# EAGLE design LED_Cube_MAX6966 (EAGLE 7.5.0)
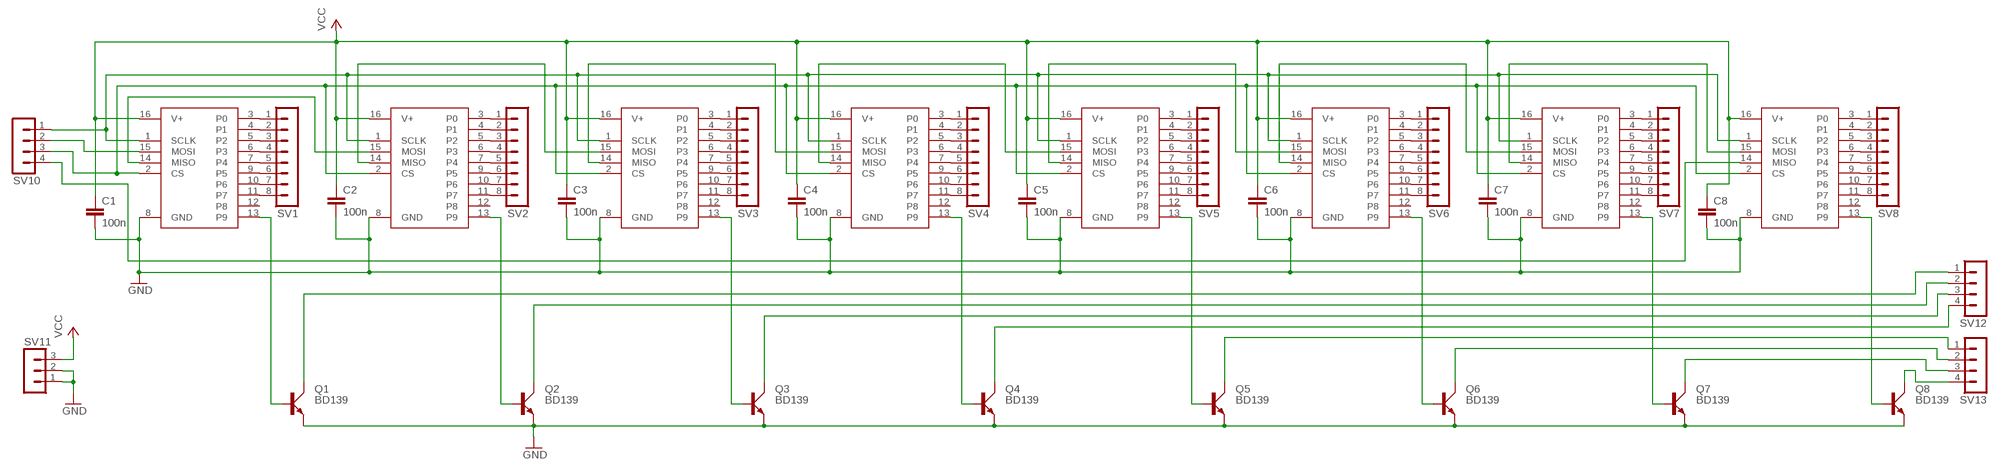
[diagram p0: schematic, sheet 1]

## Parts
C1  100n  C-EU025_050-025X075  [C025_050-025X075]
C2  100n  C-EU025_050-025X075  [C025_050-025X075]
C3  100n  C-EU025_050-025X075  [C025_050-025X075]
C4  100n  C-EU025_050-025X075  [C025_050-025X075]
C5  100n  C-EU025_050-025X075  [C025_050-025X075]
C6  100n  C-EU025_050-025X075  [C025_050-025X075]
C7  100n  C-EU025_050-025X075  [C025_050-025X075]
C8  100n  C-EU025_050-025X075  [C025_050-025X075]
Q1  BD139  [TO126AV]
Q2  BD139  [TO126AV]
Q3  BD139  [TO126AV]
Q4  BD139  [TO126AV]
Q5  BD139  [TO126AV]
Q6  BD139  [TO126AV]
Q7  BD139  [TO126AV]
Q8  BD139  [TO126AV]
SV1  MA08-1  [MA08-1]
SV2  MA08-1  [MA08-1]
SV3  MA08-1  [MA08-1]
SV4  MA08-1  [MA08-1]
SV5  MA08-1  [MA08-1]
SV6  MA08-1  [MA08-1]
SV7  MA08-1  [MA08-1]
SV8  MA08-1  [MA08-1]
SV10  MA04-1  [MA04-1]
SV11  MA03-1  [MA03-1]
SV12  MA04-1  [MA04-1]
SV13  MA04-1  [MA04-1]
U$1  MAX6966  [QSOP16]
U$2  MAX6966  [QSOP16]
U$3  MAX6966  [QSOP16]
U$4  MAX6966  [QSOP16]
U$5  MAX6966  [QSOP16]
U$6  MAX6966  [QSOP16]
U$7  MAX6966  [QSOP16]
U$8  MAX6966  [QSOP16]

## Nets
GND: C1.2 C2.2 C3.2 C4.2 C5.2 C6.2 C7.2 C8.2 Q1.E Q2.E Q3.E Q4.E Q5.E Q6.E Q7.E Q8.E SV11.1 SV11.2 U$1.8(GND) U$2.8(GND) U$3.8(GND) U$4.8(GND) U$5.8(GND) U$6.8(GND) U$7.8(GND) U$8.8(GND)
N$1: SV1.1 U$1.3(P0)
N$2: SV1.2 U$1.4(P1)
N$3: SV1.3 U$1.5(P2)
N$4: SV1.4 U$1.6(P3)
N$5: SV1.5 U$1.7(P4)
N$6: SV1.6 U$1.9(P5)
N$7: SV1.7 U$1.10(P6)
N$8: SV1.8 U$1.11(P7)
N$9: SV2.1 U$2.3(P0)
N$10: SV2.2 U$2.4(P1)
N$11: SV2.3 U$2.5(P2)
N$12: SV2.4 U$2.6(P3)
N$13: SV2.5 U$2.7(P4)
N$14: SV2.6 U$2.9(P5)
N$15: SV2.7 U$2.10(P6)
N$16: SV2.8 U$2.11(P7)
N$17: SV3.1 U$3.3(P0)
N$18: SV3.2 U$3.4(P1)
N$19: SV3.3 U$3.5(P2)
N$20: SV3.4 U$3.6(P3)
N$21: SV3.5 U$3.7(P4)
N$22: SV3.6 U$3.9(P5)
N$23: SV3.7 U$3.10(P6)
N$24: SV3.8 U$3.11(P7)
N$25: SV4.1 U$4.3(P0)
N$26: SV4.2 U$4.4(P1)
N$27: SV4.3 U$4.5(P2)
N$28: SV4.4 U$4.6(P3)
N$29: SV4.5 U$4.7(P4)
N$30: SV4.6 U$4.9(P5)
N$31: SV4.7 U$4.10(P6)
N$32: SV4.8 U$4.11(P7)
N$33: SV5.1 U$5.3(P0)
N$34: SV5.2 U$5.4(P1)
N$35: SV5.3 U$5.5(P2)
N$36: SV5.4 U$5.6(P3)
N$37: SV5.5 U$5.7(P4)
N$38: SV5.6 U$5.9(P5)
N$39: SV5.7 U$5.10(P6)
N$40: SV5.8 U$5.11(P7)
N$41: SV6.1 U$6.3(P0)
N$42: SV6.2 U$6.4(P1)
N$43: SV6.3 U$6.5(P2)
N$44: SV6.4 U$6.6(P3)
N$45: SV6.5 U$6.7(P4)
N$46: SV6.6 U$6.9(P5)
N$47: SV6.7 U$6.10(P6)
N$48: SV6.8 U$6.11(P7)
N$49: SV7.1 U$7.3(P0)
N$50: SV7.2 U$7.4(P1)
N$51: SV7.3 U$7.5(P2)
N$52: SV7.4 U$7.6(P3)
N$53: SV7.5 U$7.7(P4)
N$54: SV7.6 U$7.9(P5)
N$55: SV7.7 U$7.10(P6)
N$56: SV7.8 U$7.11(P7)
N$57: SV8.1 U$8.3(P0)
N$58: SV8.2 U$8.4(P1)
N$59: SV8.3 U$8.5(P2)
N$60: SV8.4 U$8.6(P3)
N$61: SV8.5 U$8.7(P4)
N$62: SV8.6 U$8.9(P5)
N$63: SV8.7 U$8.10(P6)
N$64: SV8.8 U$8.11(P7)
N$65: U$4.14(MISO) U$5.15(MOSI)
N$66: Q8.B U$8.13(P9)
N$67: SV10.3 U$1.2(CS) U$2.2(CS) U$3.2(CS) U$4.2(CS) U$5.2(CS) U$6.2(CS) U$7.2(CS) U$8.2(CS)
N$68: Q7.B U$7.13(P9)
N$69: Q6.B U$6.13(P9)
N$70: Q5.B U$5.13(P9)
N$71: Q4.B U$4.13(P9)
N$73: Q3.B U$3.13(P9)
N$74: Q2.B U$2.13(P9)
N$75: Q1.B U$1.13(P9)
N$77: Q8.C SV13.4
N$78: Q7.C SV13.3
N$79: SV10.1 U$1.1(SCLK) U$2.1(SCLK) U$3.1(SCLK) U$4.1(SCLK) U$5.1(SCLK) U$6.1(SCLK) U$7.1(SCLK) U$8.1(SCLK)
N$80: Q6.C SV13.2
N$81: Q5.C SV13.1
N$82: Q4.C SV12.4
N$83: Q3.C SV12.3
N$84: Q2.C SV12.2
N$85: Q1.C SV12.1
N$86: U$1.14(MISO) U$2.15(MOSI)
N$87: SV10.2 U$1.15(MOSI)
N$88: U$2.14(MISO) U$3.15(MOSI)
N$89: U$3.14(MISO) U$4.15(MOSI)
N$90: U$7.14(MISO) U$8.15(MOSI)
N$91: U$5.14(MISO) U$6.15(MOSI)
N$92: U$6.14(MISO) U$7.15(MOSI)
N$93: SV10.4 U$8.14(MISO)
VCC: C1.1 C2.1 C3.1 C4.1 C5.1 C6.1 C7.1 C8.1 SV11.3 U$1.16(V+) U$2.16(V+) U$3.16(V+) U$4.16(V+) U$5.16(V+) U$6.16(V+) U$7.16(V+) U$8.16(V+)
Unconnected: U$1.12(P8) U$2.12(P8) U$3.12(P8) U$4.12(P8) U$5.12(P8) U$6.12(P8) U$7.12(P8) U$8.12(P8)

## Library data of the parts
C1-C8 = rcl:C-EU: CAPACITOR, European symbol
Q1-Q8 = transistor-power:BD139: NPN TRANSISTOR
SV1-SV8 = con-lstb:MA08-1: PIN HEADER; OC_FARNELL: unknown; OC_NEWARK: unknown
SV10 SV12 SV13 = con-lstb:MA04-1: PIN HEADER; OC_FARNELL: unknown; OC_NEWARK: unknown
SV11 = con-lstb:MA03-1: PIN HEADER; OC_FARNELL: unknown; OC_NEWARK: unknown
U$1-U$8 = MAX6966:MAX6966

## Board
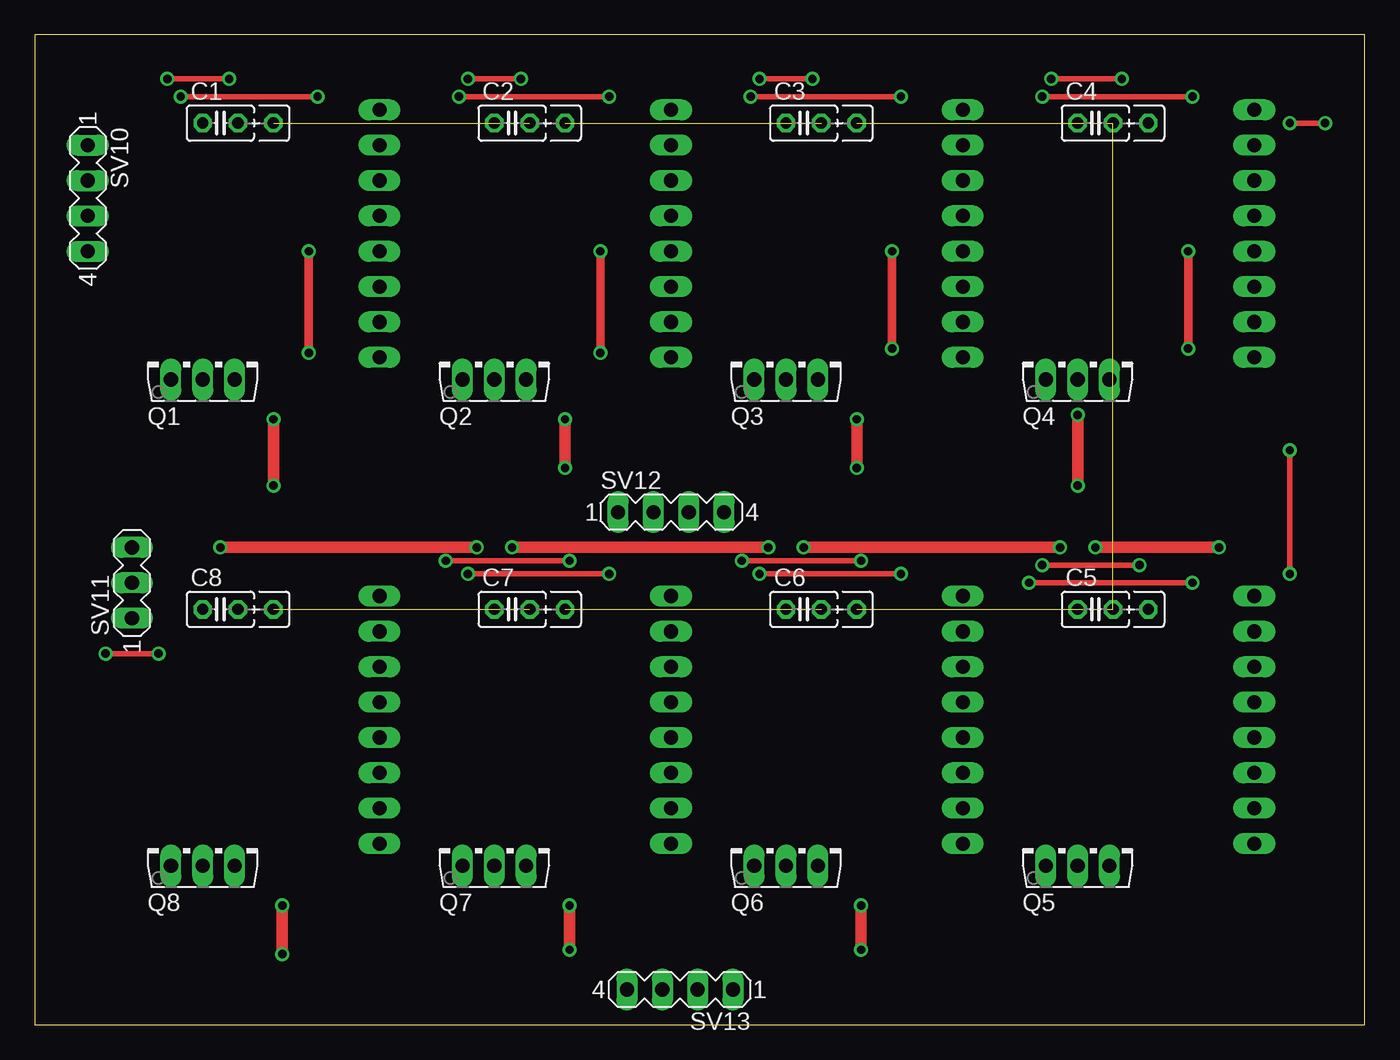
[diagram p1: board, top side]
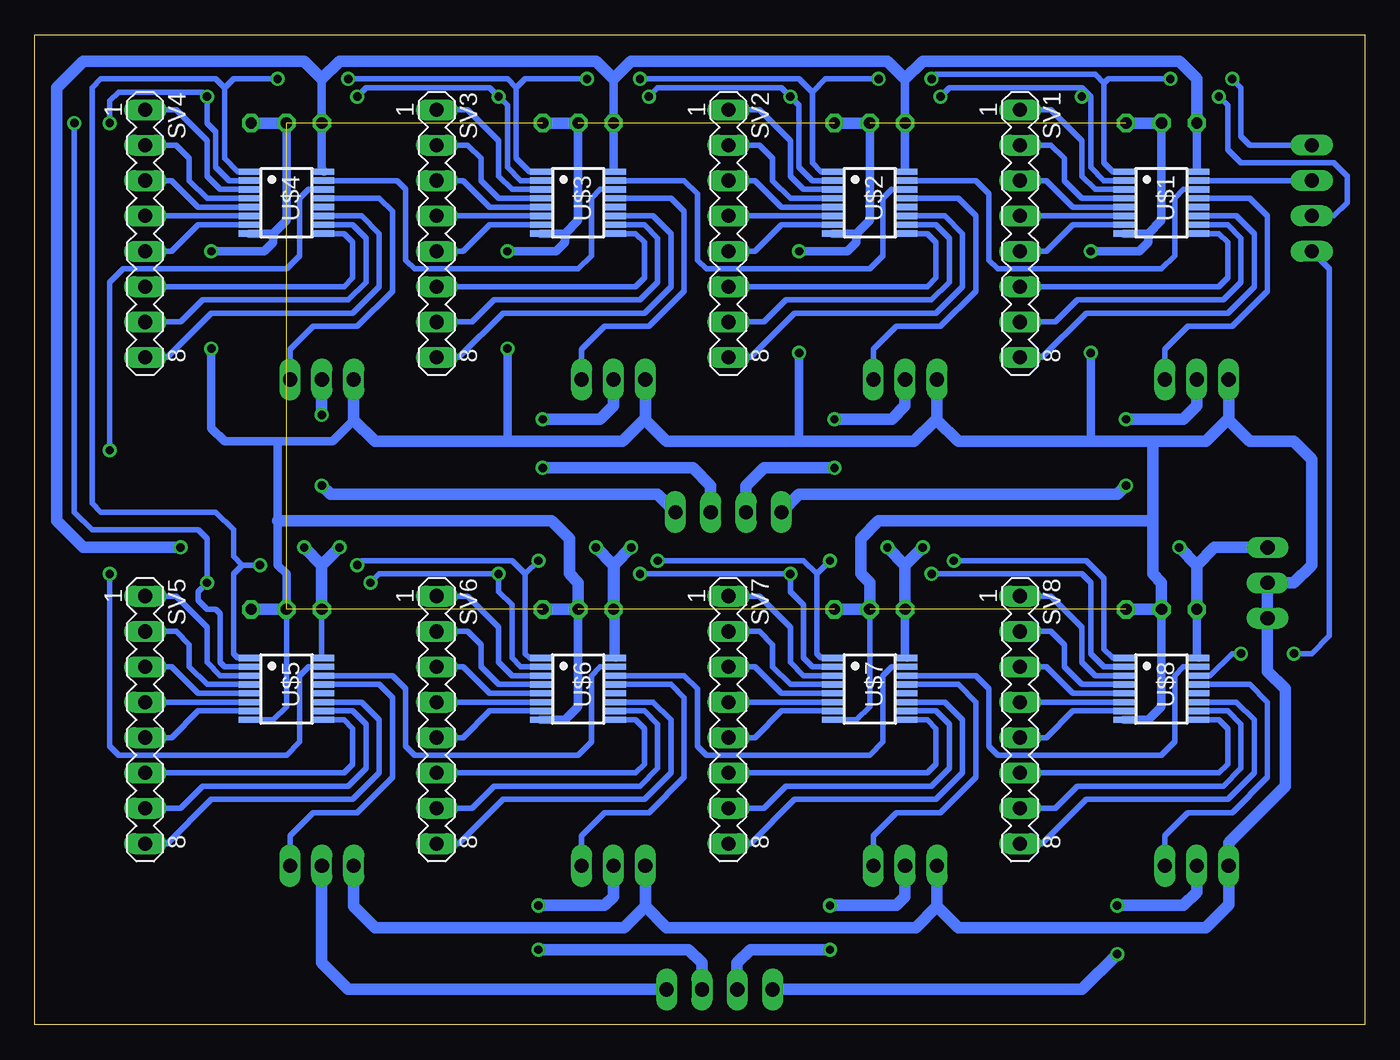
[diagram p2: board, bottom side, seen from below]

Size 95.55 x 71.11 mm. Coordinates in mm from the lower left corner, seen from the top.
Outline: 0,0 95.55,0 95.55,71.11 0,71.11 0,0
Copper layers (1*16): Top 0.035mm / dielectric 1.5mm / Bottom 0.035mm
Design rules "default": minimum track width 10mil, minimum drill 24mil, track to track 8mil, track to pad 8mil, pad to pad 8mil, via to via 8mil, smd to smd 8mil, copper to edge 40mil, drill to drill 8mil, minimum pad ring 10mil, minimum via ring 8mil, stop-mask expansion 4mil, vias tented up to drill 0mil, thermal gap 10mil

### Footprints (pad centres in the part's own frame; a part is rotated, then mirrored left to right if it is on the bottom)
C025_050-025X075 = drill 0.813 octagon: 1 -1.27,0; 2 1.27,0; 3 3.81,0
TO126AV = drill 1.016 long: B 2.286,-1.27; C 0,-1.27; E -2.286,-1.27
MA08-1 = drill 1.016 long: 1 -8.89,0; 2 -6.35,0; 3 -3.81,0; 4 -1.27,0; 5 1.27,0; 6 3.81,0; 7 6.35,0; 8 8.89,0
MA04-1 = drill 1.016 long: 1 -3.81,0; 2 -1.27,0; 3 1.27,0; 4 3.81,0
MA03-1 = drill 1.016 long: 1 -2.54,0; 2 0,0; 3 2.54,0
QSOP16 = smd 0.45 x 1.5: 1 -2.223,-2.69; 2 -1.587,-2.69; 3 -0.953,-2.69; 4 -0.318,-2.69; 5 0.318,-2.69; 6 0.953,-2.69; 7 1.587,-2.69; 8 2.223,-2.69; 9 2.223,2.69; 10 1.587,2.69; 11 0.953,2.69; 12 0.318,2.69; 13 -0.318,2.69; 14 -0.953,2.69; 15 -1.587,2.69; 16 -2.223,2.69

### Placement (x,y rotation side)
C1  13.34,64.77 0 top
C2  34.29,64.77 0 top
C3  55.25,64.77 0 top
C4  76.2,64.77 0 top
C5  76.2,29.84 0 top
C6  55.25,29.84 0 top
C7  34.29,29.84 0 top
C8  13.34,29.84 0 top
Q1  12.06,47.62 0 top
Q2  33.02,47.62 0 top
Q3  53.98,47.62 0 top
Q4  74.93,47.62 0 top
Q5  74.93,12.7 0 top
Q6  53.98,12.7 0 top
Q7  33.02,12.7 0 top
Q8  12.06,12.7 0 top
SV1  24.76,56.83 270 bottom
SV2  45.72,56.83 270 bottom
SV3  66.67,56.83 270 bottom
SV4  87.63,56.83 270 bottom
SV5  87.63,21.91 270 bottom
SV6  66.67,21.91 270 bottom
SV7  45.72,21.91 270 bottom
SV8  24.76,21.91 270 bottom
SV10  3.81,59.37 270 top
SV11  6.99,31.75 90 top
SV12  45.72,36.83 0 top
SV13  46.36,2.54 180 top
U$1  14.61,59.05 270 bottom
U$2  35.56,59.05 270 bottom
U$3  56.52,59.05 270 bottom
U$4  77.47,59.05 270 bottom
U$5  77.47,24.13 270 bottom
U$6  56.52,24.13 270 bottom
U$7  35.56,24.13 270 bottom
U$8  14.61,24.13 270 bottom

### Tracks (layer width: path | path; a pad name or v marks a point on that pad's centre or on a via)
GND  (via drill 0.6)
  Top 0.61: v19.68,55.56 v19.68,48.26 | v40.64,55.56 v40.64,48.26 | v61.59,55.56 v61.59,48.58 | v82.87,55.56 v82.87,48.58
  Bottom 0.406: C7.2 35.56,22.86 36.51,21.91 U$7.8 | C5.2 77.47,22.86 78.42,21.91 U$5.8
  Bottom 0.61: 78.42,56.83 77.47,57.79 C4.2 | 78.42,56.83 U$4.8 | U$3.8 57.47,56.83 | 57.47,56.83 56.52,57.79 C3.2 | C2.2 35.56,57.79 36.51,56.83 | U$2.8 36.51,56.83 | C1.2 14.61,57.79 15.56,56.83 | U$1.8 15.56,56.83 | C8.2 14.61,22.86 15.56,21.91 U$8.8 | C6.2 56.52,22.86 57.47,21.91 U$6.8 | 15.56,56.83 15.56,56.2 16.19,55.56 v19.68,55.56 | v19.68,48.26 19.68,41.91 | 36.51,56.83 36.51,56.2 37.15,55.56 v40.64,55.56 | v40.64,48.26 40.64,41.91 | 57.47,56.83 57.47,56.2 58.1,55.56 v61.59,55.56 | v61.59,48.58 61.59,41.91 | 78.42,56.83 78.42,56.2 79.06,55.56 v82.87,55.56 | v82.87,48.58 82.87,42.86 81.91,41.91 78.1,41.91 | 78.1,41.91 74.17,41.91 72.64,43.43 | C5.2 77.47,32.38 78.1,33.02 78.1,36.2 78.1,41.91
  Bottom 0.813: 15.24,41.91 19.68,41.91 29.21,41.91 30.73,43.43 | C6.2 56.52,31.75 57.15,32.38 57.15,34.92 58.42,36.2 78.1,36.2 | C7.2 35.56,31.75 36.2,32.38 36.2,34.92 34.93,36.2 15.24,36.2 | C8.2 14.61,31.75 15.24,32.38 15.24,36.2 | 15.24,36.2 15.24,41.91 | Q7.E 30.73,8.51 | 30.73,8.51 29.21,6.98 11.43,6.98 9.78,8.64 Q8.E 9.78,13.08 5.71,17.14 5.71,24.13 6.99,25.4 SV11.1 SV11.2 5.08,31.75 3.81,33.02 3.81,40.64 5.08,41.91 8.26,41.91 9.78,43.43 | Q6.E 51.69,8.51 | 51.69,8.51 50.16,6.98 32.26,6.98 30.73,8.51 | Q5.E 72.64,8.51 71.12,6.98 53.21,6.98 51.69,8.51 | Q1.E 9.78,43.43 | 9.78,43.43 9.91,43.43 11.43,41.91 15.24,41.91 | Q2.E 30.73,43.43 | 30.73,43.43 30.86,43.43 32.39,41.91 40.64,41.91 50.16,41.91 51.69,43.43 Q3.E 51.69,43.56 53.34,41.91 61.59,41.91 71.12,41.91 72.64,43.43 Q4.E
N$1
  Bottom 0.406: U$1.3 19.37,60.01 20.32,60.96 20.32,63.5 22.54,65.72 SV1.1
N$2
  Bottom 0.406: U$1.4 20.32,59.37 21.59,60.64 21.59,62.23 22.54,63.18 SV1.2
N$3
  Bottom 0.406: U$1.5 20.95,58.74 22.86,60.64 SV1.3
N$4
  Bottom 0.406: U$1.6 SV1.4
N$5
  Bottom 0.406: U$1.7 20.95,57.47 22.86,55.56 SV1.5
N$6
  Bottom 0.406: SV1.6 10.48,53.02 9.84,53.66 9.84,56.2 10.48,56.83 U$1.9
N$7
  Bottom 0.406: U$1.10 9.84,57.47 8.89,56.51 8.89,53.34 10.16,52.07 20.64,52.07 22.22,50.48 SV1.7
N$8
  Bottom 0.406: U$1.11 9.21,58.1 7.94,56.83 7.94,53.02 9.84,51.12 20,51.12 23.18,47.94 SV1.8
N$9
  Bottom 0.406: SV2.1 43.5,65.72 41.27,63.5 41.27,60.96 40.32,60.01 U$2.3
N$10
  Bottom 0.406: SV2.2 43.5,63.18 42.55,62.23 42.55,60.64 41.27,59.37 U$2.4
N$11
  Bottom 0.406: SV2.3 43.82,60.64 41.91,58.74 U$2.5
N$12
  Bottom 0.406: U$2.6 SV2.4
N$13
  Bottom 0.406: U$2.7 41.91,57.47 43.82,55.56 SV2.5
N$14
  Bottom 0.406: SV2.6 31.43,53.02 30.8,53.66 30.8,56.2 31.43,56.83 U$2.9
N$15
  Bottom 0.406: SV2.7 43.18,50.48 41.59,52.07 31.11,52.07 29.84,53.34 29.84,56.51 30.8,57.47 U$2.10
N$16
  Bottom 0.406: SV2.8 44.13,47.94 40.96,51.12 30.8,51.12 28.89,53.02 28.89,56.83 30.16,58.1 U$2.11
N$17
  Bottom 0.406: SV3.1 64.45,65.72 62.23,63.5 62.23,60.96 61.28,60.01 U$3.3
N$18
  Bottom 0.406: SV3.2 64.45,63.18 63.5,62.23 63.5,60.64 62.23,59.37 U$3.4
N$19
  Bottom 0.406: SV3.3 64.77,60.64 62.87,58.74 U$3.5
N$20
  Bottom 0.406: SV3.4 U$3.6
N$21
  Bottom 0.406: U$3.7 62.87,57.47 64.77,55.56 SV3.5
N$22
  Bottom 0.406: U$3.9 52.39,56.83 51.75,56.2 51.75,53.66 52.39,53.02 SV3.6
N$23
  Bottom 0.406: U$3.10 51.75,57.47 50.8,56.51 50.8,53.34 52.07,52.07 62.55,52.07 64.13,50.48 SV3.7
N$24
  Bottom 0.406: SV3.8 65.09,47.94 61.91,51.12 51.75,51.12 49.85,53.02 49.85,56.83 51.12,58.1 U$3.11
N$25
  Bottom 0.406: SV4.1 85.41,65.72 83.18,63.5 83.18,60.96 82.23,60.01 U$4.3
N$26
  Bottom 0.406: SV4.2 85.41,63.18 84.45,62.23 84.45,60.64 83.18,59.37 U$4.4
N$27
  Bottom 0.406: SV4.3 85.72,60.64 83.82,58.74 U$4.5
N$28
  Bottom 0.406: SV4.4 U$4.6
N$29
  Bottom 0.406: SV4.5 85.72,55.56 83.82,57.47 U$4.7
N$30
  Bottom 0.406: U$4.9 73.34,56.83 72.71,56.2 72.71,53.66 73.34,53.02 SV4.6
N$31
  Bottom 0.406: U$4.10 72.71,57.47 71.75,56.51 71.75,53.34 73.02,52.07 83.5,52.07 85.09,50.48 SV4.7
N$32
  Bottom 0.406: U$4.11 72.07,58.1 70.8,56.83 70.8,53.02 72.71,51.12 82.87,51.12 86.04,47.94 SV4.8
N$33
  Bottom 0.406: U$5.3 82.23,25.08 83.18,26.03 83.18,28.57 85.41,30.8 SV5.1
N$34
  Bottom 0.406: U$5.4 83.18,24.45 84.45,25.72 84.45,27.3 85.41,28.26 SV5.2
N$35
  Bottom 0.406: U$5.5 83.82,23.81 85.72,25.72 SV5.3
N$36
  Bottom 0.406: U$5.6 SV5.4
N$37
  Bottom 0.406: U$5.7 83.82,22.54 85.72,20.64 SV5.5
N$38
  Bottom 0.406: U$5.9 73.34,21.91 72.71,21.27 72.71,18.73 73.34,18.1 SV5.6
N$39
  Bottom 0.406: U$5.10 72.71,22.54 71.75,21.59 71.75,18.41 73.02,17.14 83.5,17.14 85.09,15.56 SV5.7
N$40
  Bottom 0.406: U$5.11 72.07,23.18 70.8,21.91 70.8,18.1 72.71,16.19 82.87,16.19 86.04,13.02 SV5.8
N$41
  Bottom 0.406: SV6.1 64.45,30.8 62.23,28.57 62.23,26.03 61.28,25.08 U$6.3
N$42
  Bottom 0.406: SV6.2 64.45,28.26 63.5,27.3 63.5,25.72 62.23,24.45 U$6.4
N$43
  Bottom 0.406: SV6.3 64.77,25.72 62.87,23.81 U$6.5
N$44
  Bottom 0.406: SV6.4 U$6.6
N$45
  Bottom 0.406: U$6.7 62.87,22.54 64.77,20.64 SV6.5
N$46
  Bottom 0.406: U$6.9 52.39,21.91 51.75,21.27 51.75,18.73 52.39,18.1 SV6.6
N$47
  Bottom 0.406: U$6.10 51.75,22.54 50.8,21.59 50.8,18.41 52.07,17.14 62.55,17.14 64.13,15.56 SV6.7
N$48
  Bottom 0.406: U$6.11 51.12,23.18 49.85,21.91 49.85,18.1 51.75,16.19 61.91,16.19 65.09,13.02 SV6.8
N$49
  Bottom 0.406: U$7.3 40.32,25.08 41.27,26.03 41.27,28.57 43.5,30.8 SV7.1
N$50
  Bottom 0.406: U$7.4 41.27,24.45 42.55,25.72 42.55,27.3 43.5,28.26 SV7.2
N$51
  Bottom 0.406: U$7.5 41.91,23.81 43.82,25.72 SV7.3
N$52
  Bottom 0.406: U$7.6 SV7.4
N$53
  Bottom 0.406: U$7.7 41.91,22.54 43.82,20.64 SV7.5
N$54
  Bottom 0.406: U$7.9 31.43,21.91 30.8,21.27 30.8,18.73 31.43,18.1 SV7.6
N$55
  Bottom 0.406: U$7.10 30.8,22.54 29.84,21.59 29.84,18.41 31.11,17.14 41.59,17.14 43.18,15.56 SV7.7
N$56
  Bottom 0.406: U$7.11 30.16,23.18 28.89,21.91 28.89,18.1 30.8,16.19 40.96,16.19 44.13,13.02 SV7.8
N$57
  Bottom 0.406: U$8.3 19.37,25.08 20.32,26.03 20.32,28.57 22.54,30.8 SV8.1
N$58
  Bottom 0.406: U$8.4 20.32,24.45 21.59,25.72 21.59,27.3 22.54,28.26 SV8.2
N$59
  Bottom 0.406: U$8.5 20.95,23.81 22.86,25.72 SV8.3
N$60
  Bottom 0.406: U$8.6 SV8.4
N$61
  Bottom 0.406: U$8.7 20.95,22.54 22.86,20.64 SV8.5
N$62
  Bottom 0.406: U$8.9 10.48,21.91 9.84,21.27 9.84,18.73 10.48,18.1 SV8.6
N$63
  Bottom 0.406: SV8.7 22.22,15.56 20.64,17.14 10.16,17.14 8.89,18.41 8.89,21.59 9.84,22.54 U$8.10
N$64
  Bottom 0.406: U$8.11 9.21,23.18 7.94,21.91 7.94,18.1 9.84,16.19 20,16.19 23.18,13.02 SV8.8
N$65  (via drill 0.6)
  Top 0.406: v90.17,41.27 v90.17,32.38
  Bottom 0.406: U$4.14 75.88,60.01 76.52,59.37 76.52,55.24 77.47,54.29 89.22,54.29 90.17,53.34 v90.17,41.27 | v90.17,32.38 90.17,20 89.53,19.37 77.47,19.37 76.52,20.32 76.52,25.08 75.88,25.72 U$5.15
N$66
  Bottom 0.406: U$8.13 8.26,24.45 6.99,23.18 6.99,17.78 9.53,15.24 12.7,15.24 14.35,13.59 Q8.B
N$67  (via drill 0.6)
  Top 0.406: v51.44,66.68 v62.23,66.68 | v30.48,66.68 v41.27,66.68 | v83.18,66.68 v72.39,66.68 | v31.11,32.38 v41.27,32.38 | v52.07,32.38 v62.23,32.38 | v71.44,31.75 v83.18,31.75 | v10.48,66.68 v20.32,66.68 | v92.71,64.77 v90.17,64.77
  Bottom 0.406: 38.1,60.64 U$2.2 | U$2.2 37.78,60.64 | U$1.2 18.73,60.64 19.68,61.59 19.68,66.68 20,66.99 | U$2.2 39.69,60.64 40.64,61.59 40.64,66.04 v41.27,66.68 41.91,67.31 50.8,67.31 v51.44,66.68 | U$3.2 60.64,60.64 61.59,61.59 61.59,66.04 v62.23,66.68 62.87,67.31 71.75,67.31 v72.39,66.68 | 20,66.99 20.32,67.31 29.84,67.31 v30.48,66.68 | U$4.2 81.6,60.64 82.55,61.59 82.55,64.14 83.18,64.77 v83.18,66.68 83.5,66.99 89.53,66.99 90.17,66.36 v90.17,64.77 | U$8.2 18.73,25.72 19.68,26.67 19.68,31.75 20.32,32.38 v31.11,32.38 | U$7.2 39.69,25.72 40.32,26.35 40.32,30.16 41.27,31.11 v41.27,32.38 v52.07,32.38 | U$6.2 60.64,25.72 61.28,26.35 61.28,30.16 62.23,31.11 v62.23,32.38 70.8,32.38 v71.44,31.75 | U$5.2 81.91,25.72 82.23,26.03 82.23,29.53 82.55,29.84 83.18,29.84 83.82,30.48 83.82,31.11 v83.18,31.75 83.18,34.92 83.82,35.56 91.44,35.56 92.71,36.83 v92.71,64.77 | SV10.3 2.22,58.1 1.27,59.05 1.27,60.96 2.22,61.91 8.89,61.91 9.84,62.87 9.84,66.04 v10.48,66.68 | v20.32,66.68 20,66.99
N$68
  Bottom 0.406: U$7.13 29.21,24.45 27.94,23.18 27.94,17.78 30.48,15.24 33.66,15.24 35.31,13.59 Q7.B
N$69
  Bottom 0.406: U$6.13 49.85,24.45 48.9,23.49 48.9,17.78 51.44,15.24 54.61,15.24 56.26,13.59 Q6.B
N$70
  Bottom 0.406: U$5.13 70.8,24.45 69.85,23.49 69.85,17.78 72.39,15.24 75.56,15.24 77.22,13.59 Q5.B
N$71
  Bottom 0.406: U$4.13 70.8,59.37 69.85,58.42 69.85,52.7 72.39,50.16 75.56,50.16 77.22,48.51 Q4.B
N$73
  Bottom 0.406: U$3.13 49.85,59.37 48.9,58.42 48.9,52.7 51.44,50.16 54.61,50.16 56.26,48.51 Q3.B
N$74
  Bottom 0.406: U$2.13 29.21,59.37 27.94,58.1 27.94,52.7 30.48,50.16 33.66,50.16 35.31,48.51 Q2.B
N$75
  Bottom 0.406: U$1.13 8.26,59.37 6.99,58.1 6.99,52.7 9.53,50.16 12.7,50.16 14.35,48.51 Q1.B
N$77  (via drill 0.6)
  Top 0.813: v17.78,8.57 v17.78,5.08
  Bottom 0.813: Q8.C 12.06,9.53 13.02,8.57 v17.78,8.57 | v17.78,5.08 20.32,2.54 SV13.4
N$78  (via drill 0.6)
  Top 0.813: v38.42,8.57 v38.42,5.4
  Bottom 0.813: Q7.C 33.02,9.21 33.66,8.57 v38.42,8.57 | v38.42,5.4 44.13,5.4 45.09,4.44 SV13.3
N$79  (via drill 0.6)
  Top 0.406: v52.07,67.95 v55.88,67.95 | v31.11,67.95 v34.93,67.95 | v73.02,67.95 v78.1,67.95 | v29.53,33.34 v38.42,33.34 | v50.8,33.34 v59.37,33.34 | v72.39,33.02 v79.38,33.02 | v9.53,67.95 v13.97,67.95
  Bottom 0.406: U$1.1 18.1,61.28 18.73,61.91 18.73,67.63 | U$2.1 39.05,61.28 39.69,61.91 39.69,66.99 | U$3.1 60.01,61.28 60.96,62.23 60.96,67.31 | U$4.1 80.96,61.28 81.91,62.23 81.91,67.31 | 39.69,66.99 40.64,67.95 v52.07,67.95 | v55.88,67.95 60.33,67.95 60.96,67.31 | v31.11,67.95 30.8,68.26 19.37,68.26 18.73,67.63 | v34.93,67.95 38.73,67.95 39.69,66.99 | 60.96,67.31 61.59,67.95 v73.02,67.95 | v78.1,67.95 81.28,67.95 81.91,67.31 | U$8.1 18.1,26.35 18.73,26.99 18.73,32.07 20,33.34 v29.53,33.34 | 39.37,32.38 39.37,26.67 39.05,26.35 U$7.1 | v38.42,33.34 39.37,32.38 | 39.37,32.38 40.32,33.34 v50.8,33.34 | 60.33,32.38 60.33,26.67 60.01,26.35 U$6.1 | v59.37,33.34 60.33,32.38 | 60.33,32.38 61.28,33.34 72.07,33.34 v72.39,33.02 | U$5.1 80.96,26.35 81.28,26.67 81.28,32.38 80.64,33.02 | 80.64,33.02 v79.38,33.02 | v9.53,67.95 8.89,67.31 8.89,63.82 8.26,63.18 SV10.1 | v13.97,67.95 18.41,67.95 18.73,67.63 | 81.91,67.31 82.55,67.95 90.8,67.95 91.44,67.31 91.44,37.46 90.8,36.83 82.55,36.83 81.28,35.56 81.28,33.65 80.64,33.02
N$80  (via drill 0.6)
  Top 0.813: v59.37,8.57 v59.37,5.4
  Bottom 0.813: Q6.C 53.98,9.21 54.61,8.57 v59.37,8.57 | v59.37,5.4 48.58,5.4 47.62,4.44 SV13.2
N$81
  Bottom 0.813: Q5.C 74.93,4.44 73.02,2.54 SV13.1
N$82  (via drill 0.6)
  Top 0.813: v74.93,38.73 v74.93,43.81
  Bottom 0.813: SV12.4 50.8,38.1 74.3,38.1 v74.93,38.73 | v74.93,43.81 Q4.C
N$83  (via drill 0.6)
  Top 0.813: v59.05,43.5 v59.05,40
  Bottom 0.813: Q3.C 53.98,44.45 54.93,43.5 v59.05,43.5 | v59.05,40 48.26,40 46.99,38.73 SV12.3
N$84  (via drill 0.6)
  Top 0.813: v38.1,43.5 v38.1,40
  Bottom 0.813: Q2.C 33.02,44.45 33.97,43.5 v38.1,43.5 | v38.1,40 43.18,40 44.45,38.73 SV12.2
N$85  (via drill 0.6)
  Top 0.813: v17.14,38.73 v17.14,43.5
  Bottom 0.813: Q1.C 12.06,44.45 13.02,43.5 v17.14,43.5 | SV12.1 40.64,38.1 17.78,38.1 v17.14,38.73
N$86
  Bottom 0.406: U$1.14 13.02,60.01 13.65,59.37 13.65,55.24 14.61,54.29 26.35,54.29 26.99,54.93 26.99,59.69 27.94,60.64 U$2.15
N$87
  Bottom 0.406: SV10.2 U$1.15
N$88
  Bottom 0.406: U$3.15 48.9,60.64 47.94,59.69 47.94,54.93 47.31,54.29 35.56,54.29 34.61,55.24 34.61,59.37 33.97,60.01 U$2.14
N$89
  Bottom 0.406: U$3.14 54.93,60.01 55.56,59.37 55.56,55.24 56.52,54.29 68.26,54.29 68.9,54.93 68.9,60.01 69.53,60.64 U$4.15
N$90
  Bottom 0.406: U$7.14 27.94,25.08 26.99,24.13 26.99,20 26.35,19.37 14.61,19.37 13.65,20.32 13.65,25.08 13.02,25.72 U$8.15
N$91
  Bottom 0.406: U$6.15 54.93,25.72 55.56,25.08 55.56,20.32 56.52,19.37 68.26,19.37 68.9,20 68.9,24.13 69.85,25.08 U$5.14
N$92
  Bottom 0.406: U$6.14 48.9,25.08 47.94,24.13 47.94,20 47.31,19.37 35.56,19.37 34.61,20.32 34.61,25.08 33.97,25.72 U$7.15
N$93  (via drill 0.6)
  Top 0.406: v5.08,26.67 v8.89,26.67
  Bottom 0.406: SV10.4 2.54,54.29 2.54,27.94 3.81,26.67 v5.08,26.67 | U$8.14 11.11,25.08 9.53,26.67 v8.89,26.67
N$96
  Bottom 0.406: 45.72,58.1 38.1,58.1
N$100
  Bottom 0.406: 45.72,47.94 44.13,47.94
N$127
  Bottom 0.406: 53.83,21.91 52.39,21.91 51.75,21.27 51.75,18.73 52.39,18.1 66.67,18.1
N$128
  Bottom 0.406: 53.83,22.54 51.75,22.54 50.8,21.59 50.8,18.41 52.07,17.14 62.55,17.14 64.13,15.56 66.67,15.56
N$129
  Bottom 0.406: 66.67,13.02 65.09,13.02 61.91,16.19 51.75,16.19 49.85,18.1 49.85,21.91 51.12,23.18 53.83,23.18
N$154  (7 unrouted)
  Bottom 0.813: 14.61,29.84 17.14,29.84 | 35.56,29.84 38.1,29.84 | 56.52,29.84 59.05,29.84 | 77.47,29.84 80.01,29.84 | 77.47,64.77 80.01,64.77 | 56.52,64.77 59.05,64.77 | 35.56,64.77 38.1,64.77 | 14.61,64.77 17.14,64.77
N$155
  Bottom 0.813: 53.98,46.35 53.98,44.45 54.93,43.5 59.05,43.5
VCC  (via drill 0.6)
  Top 0.813: v13.34,34.29 v31.75,34.29 | v34.29,34.29 v52.71,34.29 | v55.25,34.29 v73.66,34.29 | v76.2,34.29 v85.09,34.29
  Bottom 0.406: 11.43,61.28 U$1.16 12.06,61.43 | 53.98,61.43 U$3.16 | 33.02,61.43 U$2.16 | U$4.16 74.78,61.45 74.93,61.59 | C5.1 74.93,26.5 U$5.16
  Bottom 0.61: U$4.16 74.93,61.43 74.93,61.59 C4.1 74.93,67.95 | 53.98,61.43 C3.1 53.98,67.95 | 33.02,61.43 C2.1 33.02,67.95 | C1.1 12.06,61.43 | U$8.16 12.06,26.5 C8.1 | C7.1 33.02,26.5 U$7.16 | C6.1 53.98,26.5 U$6.16 53.83,33.17
  Bottom 0.813: C1.1 12.06,67.95 13.34,69.22 31.75,69.22 33.02,67.95 34.29,69.22 52.71,69.22 53.98,67.95 55.25,69.22 73.66,69.22 74.93,67.95 76.2,69.22 92.07,69.22 93.98,67.31 93.98,36.2 92.07,34.29 v85.09,34.29 | v76.2,34.29 74.93,33.02 | v55.25,34.29 53.98,33.02 | 53.98,33.02 C6.1 | C8.1 12.06,33.02 | 12.06,33.02 v13.34,34.29 | 33.02,33.02 C7.1 | SV11.3 10.79,34.29 12.06,33.02 | 53.83,33.17 v52.71,34.29 53.98,33.02 | v34.29,34.29 33.02,33.02 | v31.75,34.29 33.02,33.02 | v73.66,34.29 74.93,33.02 | 74.93,33.02 C5.1
VCC1
  Bottom 0.406: 32.39,61.28 32.87,61.28
VCC4
  Bottom 0.406: 32.39,26.35 32.87,26.35